# Altium schematic sheet RS485.SchDoc
size A4; SheetNumber: 3; SheetTotal: 5
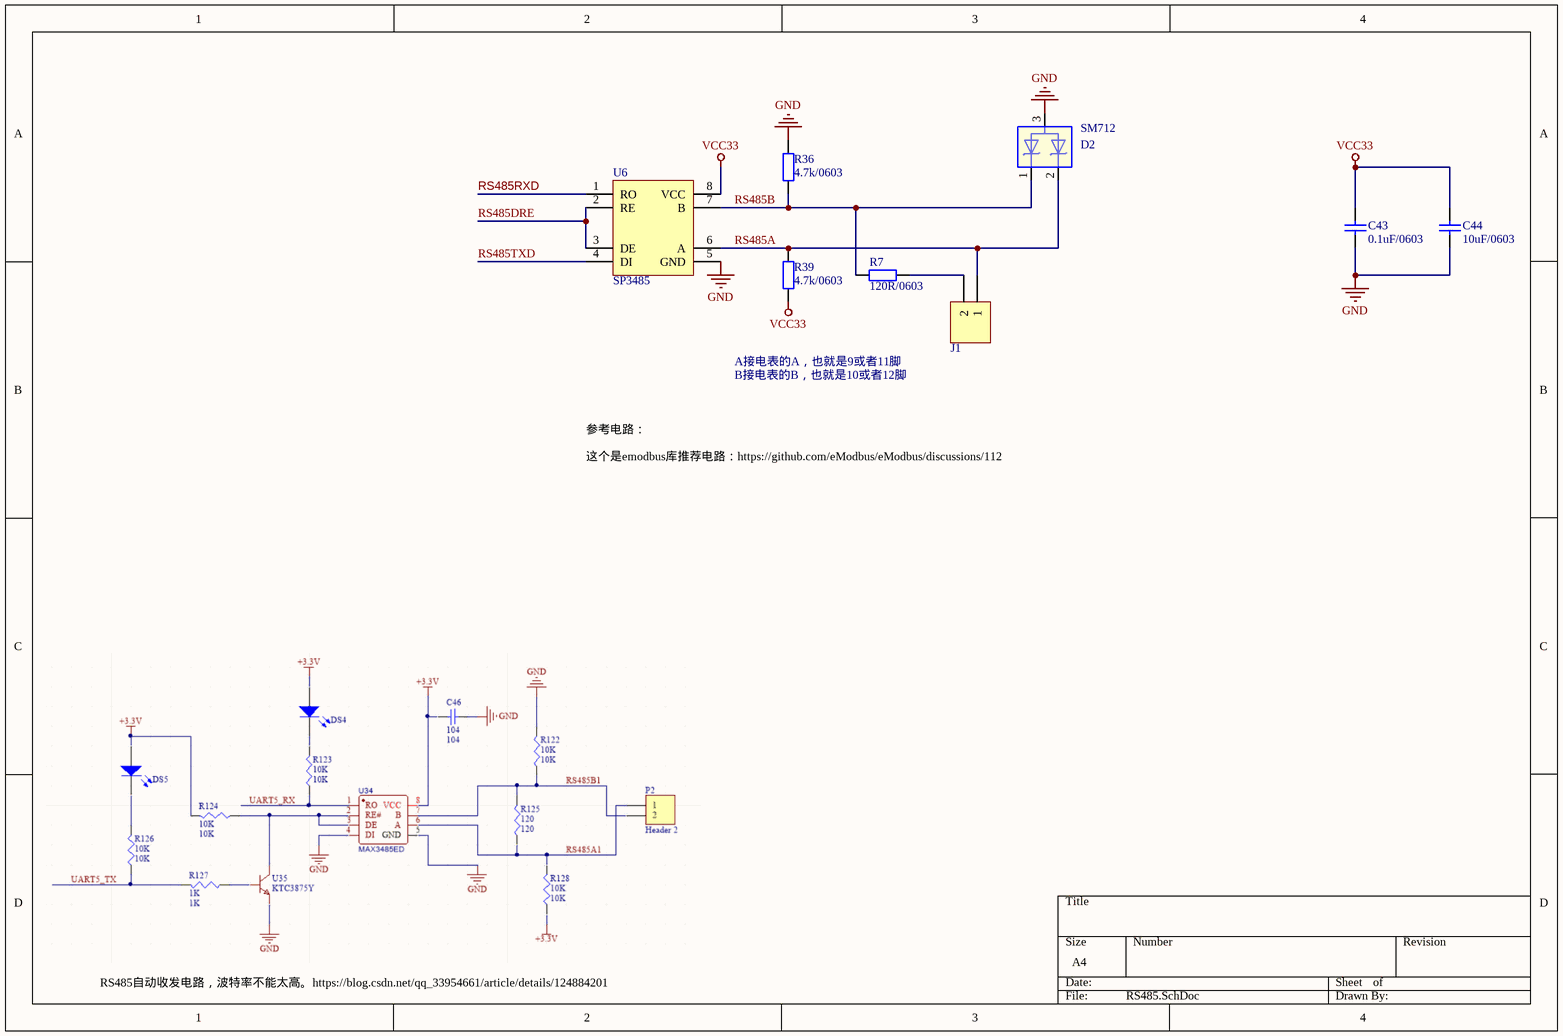
[diagram p0: RS485.SchDoc]

## Parts
C43  0.1uF/0603  [CAP0603]
C44  10uF/0603  [CAP0603]
D2  SM712  [SOT95P280X135-3N]
J1  Jumper  [HDR1X2]  (value not drawn)
R7  120R/0603  [RES0603]
R36  4.7k/0603  [RES0603]
R39  4.7k/0603  [RES0603]
U6  SP3485  [SP3485-SOP8]

## Nets
GND: C43.1 C44.1 D2.3 R36.1 U6.5(GND)
VCC33: C43.2 C44.2 R39.2 U6.8(VCC)
RS485A: D2.2 J1.1 R39.1 U6.6(A)
RS485B: D2.1 R7.1 R36.2 U6.7(B)
RS485DRE: U6.2(RE) U6.3(DE)
RS485RXD: U6.1(RO)
RS485TXD: U6.4(DI)
NetJ1_2: J1.2 R7.2

## Notes on the sheet
- A接电表的A，也就是9或者11脚
- B接电表的B，也就是10或者12脚
- 参考电路：https://components101.com/ics/sp3485-half-duplex-rs485-transceiver-ic
- 这个是emodbus库推荐电路：https://github.com/eModbus/eModbus/discussions/112
- RS485自动收发电路，波特率不能太高。https://blog.csdn.net/qq_33954661/article/details/124884201

## Library data of the parts
C43 = Cap Semi: Capacitor (Semiconductor SIM Model); Value: 100pF; Published: 8-Jun-2000; LatestRevisionDate: 29-May-2009; LatestRevisionNote: IPC-7351 Footprint Added.; PackageReference: C1206; Publisher: Altium Limited; PackageDescription: Chip Capacitor
C44 = Cap Semi: Capacitor (Semiconductor SIM Model); Value: 10uf; Published: 8-Jun-2000; LatestRevisionDate: 29-May-2009; LatestRevisionNote: IPC-7351 Footprint Added.; PackageReference: C1206; Publisher: Altium Limited; PackageDescription: Chip Capacitor
D2 = SM05_D24: 兩路TVS二极管阵列; Part Number: 702112964; Origin: Altium; Design: 3; PCB Footprint: SOT95P280X135-3N
J1 = Header 2: Header, 2-Pin; LatestRevisionDate: 17-Jul-2002; LatestRevisionNote: Re-released for DXP Platform.; Publisher: Altium Limited
R7 = Res2: Resistor; Published: 8-Jun-2000; LatestRevisionDate: 17-Jul-2002; LatestRevisionNote: Re-released for DXP Platform.; PackageReference: AXIAL-0.4; Publisher: Altium Limited; PackageDescription: Axial Device, Thru-Hole; 2 Leads; 0.4 in Pin Spacing
R36 R39 = Res2: Published: 8-Jun-2000; LatestRevisionDate: 17-Jul-2002; LatestRevisionNote: Re-released for DXP Platform.; PackageReference: AXIAL-0.4; Publisher: Altium Limited; PackageDescription: Axial Device, Thru-Hole; 2 Leads; 0.4 in Pin Spacing
U6 = SP3485: 485总线芯片